# Altium schematic sheet LEDsheet.SchDoc
size A4
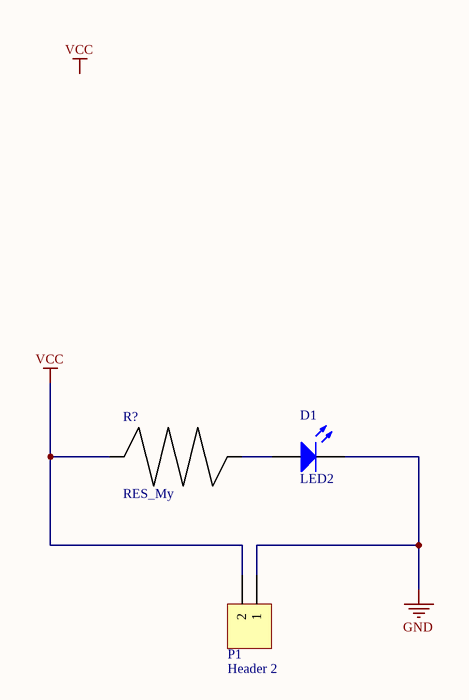
[diagram p0: LEDsheet.SchDoc]

## Parts
D1  LED2  [3.2X1.6X1.1]
P1  Header 2  [HDR1X2]
R?  RES_My  [RES_My_lead]

## Nets
GND: D1.2(K) P1.1
VCC: P1.2 R?.1
NetD1_1: D1.1(A) R?.2

## Notes on the sheet
- Labels drawn without touching a wire or pin: VCC

## Library data of the parts
D1 = LED2: Typical RED, GREEN, YELLOW, AMBER GaAs LED; Published: 8-Jun-2000; LatestRevisionDate: 17-Jul-2002; LatestRevisionNote: Re-released for DXP Platform.; PackageVersion: Feb-2002; PackageReference: 3.2X1.6X1.1; Publisher: Altium Limited; PackageDescription: SM LED; 2 Flat Leads
P1 = Header 2: Header, 2-Pin; LatestRevisionDate: 17-Jul-2002; LatestRevisionNote: Re-released for DXP Platform.; Publisher: Altium Limited